# EAGLE schematic ModbusGateway4GWiFi (EAGLE 9.6.2)
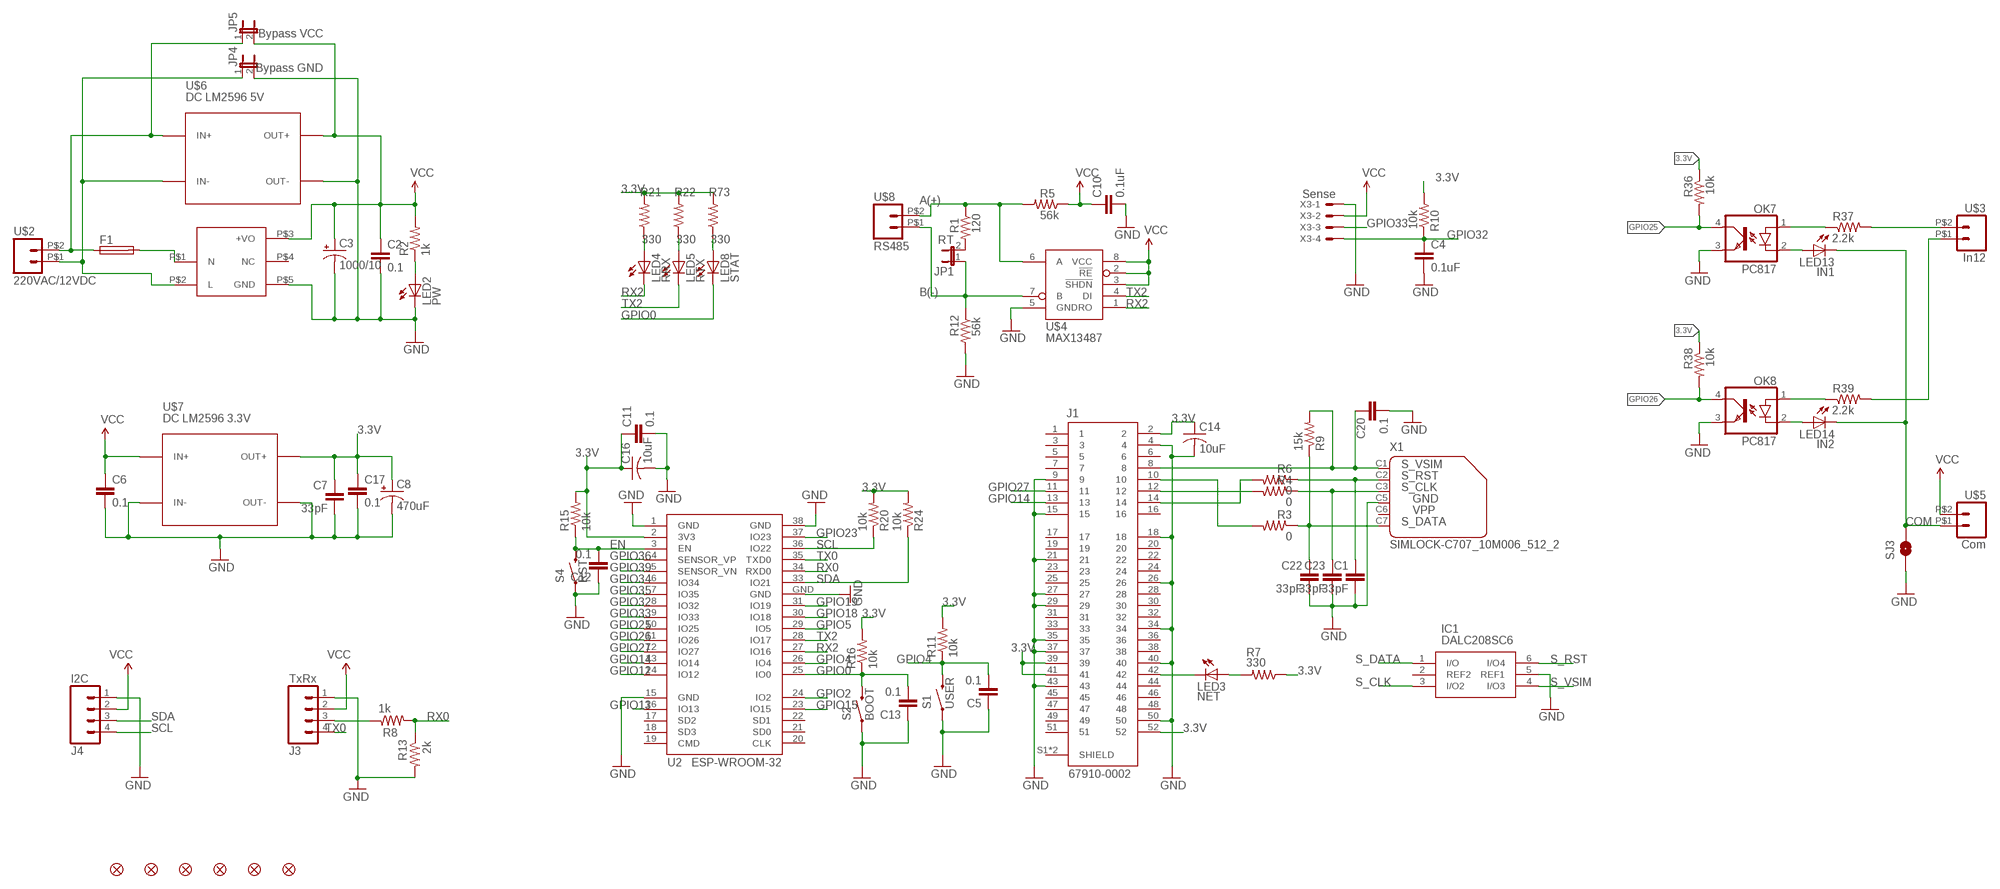
[diagram p0: schematic, sheet 1]

## Parts
C1  33pF  CAP0805  [0805]
C2  0.1  CAP0805  [0805]
C3  1000/10  CPOL-US140CLH-1010  [140CLH-1010]
C4  0.1uF  CAP0805  [0805]
C5  0.1  CAP0805  [0805]
C6  0.1  CAP0805  [0805]
C7  33pF  CAP0805  [0805]
C8  470uF  CPOL-US175TMP-0810  [175TMP-0810]
C10  0.1uF  CAP0805  [0805]
C11  0.1  CAP0805  [0805]
C12  0.1  CAP0805  [0805]
C13  0.1  CAP0805  [0805]
C14  10uF  C-USC1206  [C1206]
C16  10uF  C-USC1206  [C1206]
C17  0.1  CAP0805  [0805]
C20  0.1  CAP0805  [0805]
C22  33pF  CAP0805  [0805]
C23  33pF  CAP0805  [0805]
F1  SH22,5A  [SH22,5A]
IC1  DALC208SC6  [SOT95P280X145-6N]
J1  67910-0002  [MOLEX_67910-0002]
J3  TxRx  M04POLAR  [MOLEX-1X4]
J4  I2C  M04POLAR  [MOLEX-1X4]
JP1  RT  JUMPER-2PTH  [1X02]
JP4  Bypass GND  JUMPER-2SMD-NO  [SJ_2S-NO]
JP5  Bypass VCC  JUMPER-2SMD-NO  [SJ_2S-NO]
JP8  FIDUCIAL1X2  [FIDUCIAL-1X2]
JP9  FIDUCIAL1X2  [FIDUCIAL-1X2]
JP10  FIDUCIAL1X2  [FIDUCIAL-1X2]
JP11  FIDUCIAL1X2  [FIDUCIAL-1X2]
JP12  FIDUCIAL1X2  [FIDUCIAL-1X2]
JP16  FIDUCIAL1X2  [FIDUCIAL-1X2]
LED2  PW  LEDCHIP-LED0805  [CHIP-LED0805]
LED3  NET  LEDCHIP-LED0805  [CHIP-LED0805]
LED4  RRX  LEDCHIP-LED0805  [CHIP-LED0805]
LED5  RTX  LEDCHIP-LED0805  [CHIP-LED0805]
LED8  STAT  LEDCHIP-LED0805  [CHIP-LED0805]
LED13  IN1  LEDCHIP-LED0805  [CHIP-LED0805]
LED14  IN2  LEDCHIP-LED0805  [CHIP-LED0805]
OK7  PC817  LTV816S  [DIL4-SMD]
OK8  PC817  LTV816S  [DIL4-SMD]
R1  120  RESISTOR0805-RES  [0805]
R2  1k  RESISTOR0805-RES  [0805]
R3  0  RESISTOR0805-RES  [0805]
R4  0  RESISTOR0805-RES  [0805]
R5  56k  RESISTOR0805-RES  [0805]
R6  0  RESISTOR0805-RES  [0805]
R7  330  RESISTOR0805-RES  [0805]
R8  1k  RESISTOR0805-RES  [0805]
R9  15k  RESISTOR0805-RES  [0805]
R10  10k  RESISTOR0805-RES  [0805]
R11  10k  RESISTOR0805-RES  [0805]
R12  56k  RESISTOR0805-RES  [0805]
R13  2k  RESISTOR0805-RES  [0805]
R15  10k  RESISTOR0805-RES  [0805]
R16  10k  RESISTOR0805-RES  [0805]
R20  10k  RESISTOR0805-RES  [0805]
R21  330  RESISTOR0805-RES  [0805]
R22  330  RESISTOR0805-RES  [0805]
R24  10k  RESISTOR0805-RES  [0805]
R36  10k  RESISTOR0805-RES  [0805]
R37  2.2k  RESISTOR0805-RES  [0805]
R38  10k  RESISTOR0805-RES  [0805]
R39  2.2k  RESISTOR0805-RES  [0805]
R73  330  RESISTOR0805-RES  [0805]
S1  USER  SWITCH-MOMENTARY-2SMD-1101NE  [TACTILE-SWITCH-1101NE]
S2  BOOT  SWITCH-MOMENTARY-2SMD-1101NE  [TACTILE-SWITCH-1101NE]
S4  RST  SWITCH-MOMENTARY-2SMD-1101NE  [TACTILE-SWITCH-1101NE]
SJ3  JUMP COM to GND  SOLDERJUMPERNO  [SJ_2S-NO]
U2  ESP-WROOM-32  [ESP-WROOM-32]
U$1  HIECUBE  [HIECUBE]
U$2  220VAC/12VDC  5EHDRC-2P  [5EHDRC-2P]
U$3  In12  5EHDRC-2P  [5EHDRC-2P]
U$4  MAX13487  [SOIC8-1.27-5X4MM]
U$5  Com  5EHDRC-2P  [5EHDRC-2P]
U$6  DC LM2596 5V  DC-DC-STEP-DOWN-LM2596  [DC-DC-STEP-DOWN-LM2596]
U$7  DC LM2596 3.3V  DC-DC-STEP-DOWN-LM2596  [DC-DC-STEP-DOWN-LM2596]
U$8  RS485  5EHDRC-2P  [5EHDRC-2P]
X1  SIMLOCK-C707_10M006_512_2  [C707_10M006_512_2]
X3  Sense  JST-XH-04-PIN-LONG-PAD  [JST-XH-04-PACKAGE-LONG-PAD]

## Nets
3.3V: C7.1 C8.+ C11.1 C14.1 C16.1 C17.1 J1.2 J1.39 J1.41 J1.52 R7.1 R10.2 R11.2 R15.2 R16.2 R20.2 R21.2 R22.2 R24.2 R36.1 R38.1 R73.2 U2.2(3V3) U$7.OUT+
A(+): R1.1 R5.2 U$4.6(A) U$8.P$2
B(-): JP1.1 R12.1 U$4.7(B) U$8.P$1
COM: LED13.C LED14.C SJ3.2 U$5.P$1
EN: C12.2 R15.1 S4.2 U2.3(EN)
GND: C1.2 C2.2 C3.- C4.2 C5.1 C6.2 C7.2 C8.- C10.2 C11.2 C12.1 C13.1 C14.2 C16.2 C17.2 C20.2 C22.2 C23.2 IC1.5(REF1) J1.4 J1.9 J1.15 J1.18 J1.21 J1.26 J1.27 J1.29 J1.34 J1.35 J1.37 J1.40 J1.43 J1.50 J3.1 J4.1 JP4.2 LED2.C OK7.3(EMIT) OK8.3(EMIT) R12.2 R13.2 S1.1 S2.1 S4.1 SJ3.1 U2.1(GND) U2.15(GND) U2.38(GND) U2.GND U$1.P$5(GND) U$4.5(GND) U$6.OUT- U$7.IN- U$7.OUT- X1.C5 X3.1
GPIO0: C13.2 LED8.C R16.1 S2.2 U2.25(IO0)
GPIO2: U2.24(IO2)
GPIO4: C5.2 R11.1 S1.2 U2.26(IO4)
GPIO5: U2.29(IO5)
GPIO12: U2.14(IO12)
GPIO13: U2.16(IO13)
GPIO14: J1.13 U2.13(IO14)
GPIO15: U2.23(IO15)
GPIO18: U2.30(IO18)
GPIO19: U2.31(IO19)
GPIO23: U2.37(IO23)
GPIO25: OK7.4(COL) R36.2 U2.10(IO25)
GPIO26: OK8.4(COL) R38.2 U2.11(IO26)
GPIO27: J1.11 U2.12(IO27)
GPIO32: C4.1 R10.1 U2.8(IO32) X3.4
GPIO33: U2.9(IO33) X3.3
GPIO34: U2.6(IO34)
GPIO35: U2.7(IO35)
GPIO36: U2.4(SENSOR_VP)
GPIO39: U2.5(SENSOR_VN)
N$1: JP1.2 R1.2
N$3: J1.10 R3.2
N$5: JP4.1 U$1.P$2(L) U$2.P$1 U$6.IN-
N$6: LED2.A R2.1
N$7: J1.12 R4.2
N$8: J3.3 R8.1
N$10: J1.14 R6.2
N$14: J1.42 LED3.C
N$15: LED3.A R7.2
N$26: F1.2 U$1.P$1(N)
N$48: LED4.A R21.1
N$49: LED5.A R22.1
N$54: LED8.A R73.1
N$60: OK7.1(A) R37.1
N$62: LED13.A OK7.2(C)
N$63: OK8.1(A) R39.1
N$65: LED14.A OK8.2(C)
N$68: R37.2 U$3.P$2
N$71: R39.2 U$3.P$1
RX0: R8.2 R13.1 U2.34(RXD0)
RX2: LED4.C U2.27(IO16) U$4.1(RO)
S_CLK: C23.1 IC1.3(I/O2) R4.1 X1.C3
S_DATA: C22.1 IC1.1(I/O) R3.1 R9.1 X1.C7
S_RST: C1.1 IC1.6(I/O4) R6.1 X1.C2
S_VSIM: C20.1 IC1.4(I/O3) J1.8 R9.2 X1.C1
SCL: J4.4 R20.1 U2.36(IO22)
SDA: J4.3 R24.1 U2.33(IO21)
TX0: J3.4 U2.35(TXD0)
TX2: LED5.C U2.28(IO17) U$4.4(DI)
VCC: C2.1 C3.+ C6.1 C10.1 J3.2 J4.2 JP5.2 R2.2 R5.1 U$1.P$3(+VO) U$4.2(!RE) U$4.3(!SHDN) U$4.8(VCC) U$5.P$2 U$6.OUT+ U$7.IN+ X3.2
VS: F1.1 JP5.1 U$2.P$2 U$6.IN+
Unconnected: IC1.2(REF2) J1.1 J1.3 J1.5 J1.6 J1.7 J1.16 J1.17 J1.19 J1.20 J1.22 J1.23 J1.24 J1.25 J1.28 J1.30 J1.31 J1.32 J1.33 J1.36 J1.38 J1.44 J1.45 J1.46 J1.47 J1.48 J1.49 J1.51 J1.S1(SHIELD) J1.S2(SHIELD) U2.17(SD2) U2.18(SD3) U2.19(CMD) U2.20(CLK) U2.21(SD0) U2.22(SD1) U$1.P$4(NC) X1.C6

## Notes on the sheet
- GND
- VPP

## Library data of the parts
C1 C2 C4-C7 C10-C13 C17 C20 C22 C23 = SparkFun-Passives:CAP: Capacitor Standard 0603 ceramic capacitor, and 0.1" leaded capacitor.
C3 C8 = adafruit:CPOL-US: POLARIZED CAPACITOR, American symbol
C14 C16 = adafruit:C-US: CAPACITOR, American symbol
F1 = fuse:SH22,5A: FUSE HOLDER grid 22,5mm, isolated cap OGN0031 8201, Schurter (Buerklin)
IC1 = SamacSys_Parts:DALC208SC6: TVS Diode Array DALC208SC6 Octal, SOT-23 6-Pin Source: Datasheet <https://componentsearchengine.com/Datasheets/1/DALC208SC6.pdf>; DESCRIPTION: TVS Diode Array DALC208SC6 Octal, SOT-23 6-Pin; HEIGHT: 1.45mm; MANUFACTURER_NAME: STMicroelectronics; MANUFACTURER_PART_NUMBER: DALC208SC6; MOUSER_PART_NUMBER: 511-DALC208SC6; MOUSER_PRICE-STOCK: https://www.mouser.com/Search/Refine.aspx?Keyword=511-DALC208SC6
J1 = 67910-0002:67910-0002: 52 Position Female Connector PCI Express Mini Card Gold 0.031" (0.80mm) Black Check prices <https://pricing.snapeda.com/parts/67910-0002/Molex/view-part?ref=eda>; AVAILABILITY: Warning; DESCRIPTION: 52 Position Female Connector PCI Express Mini Card Gold 0.031 (0.80mm) Black; MF: Molex; MP: 67910-0002; PACKAGE: None; PRICE: None; PURCHASE-URL: https://pricing.snapeda.com/search/part/67910-0002/?ref=eda
J3 J4 = SparkFun-Connectors:M04: Header 4 Standard 4-pin 0.1" header. Use with straight break away headers (SKU : PRT-00116), right angle break away headers (PRT-00553), swiss pins (PRT-00743), machine pins (PRT-00117), and female headers (PRT-00115). Molex polarized connector foot print use with SKU : PRT-08231 with associated crimp pins and housings. 1MM SMD Version SKU: PRT-10208
JP1 = SparkFun:JUMPER-2: Jumper Basic 0.1" spaced jumper. Use with breakaway headers.
JP4 JP5 = SparkFun-Retired:JUMPER-2: Jumper Basic 0.1" spaced jumper. Use with breakaway headers.
JP8-JP12 JP16 = SparkFun:FIDUCIAL: Fiducial Alignment Points Various fiducial points for machine vision alignment.
LED2-LED5 LED8 = led:LED: LED
LED13 LED14 = adafruit:LED: LED
OK7 OK8 = optocoupler:LTV816: OPTO COUPLER Source: LITEON, LTV816.pdf
R1-R13 R15 R16 R20-R22 R24 R36-R39 R73 = SparkFun-Resistors:RESISTOR: Resistor Basic schematic elements and footprints for 0603, 1206, and PTH resistors.
S1 S2 S4 = SparkFun-Electromechanical:SWITCH-MOMENTARY-2: Various NO switches- pushbuttons, reed, etc; PROD_ID: SWCH-00815
SJ3 = SparkFun:SOLDERJUMPER: Solder Jumper Standard SMD solder jumper. Used to automate production. Two varients : Normally Open and Normally Closed are the same, but have different paste layers. NC will have a large amount of paste and should jumper during reflow.
U2 = esp32:ESP-WROOM-32: Espressif Systems ESP-WROOM-32
U$1 = HICUBE:HIECUBE
U$2 U$3 U$5 U$8 = ES-CONNECTOR:5EHDRC-2P
U$4 = TCS-MAXIM:MAX13487
U$6 U$7 = diy-modules:DC-DC-STEP-DOWN-LM2596: DC/DC Step-Down Regulator based on LM2596-ADJ chip LM2596 datasheet available here: http://www.ti.com/lit/ds/symlink/lm2596.pdf Click here to find device on ebay.com <http://www.ebay.com/sch/lm2596+power+regulator>
X1 = con-amphenol:SIMLOCK-C707_10M006_512_2: C707A SIMLOCK® 2.5 mm with wide solder tails Source: Data sheet <http://www.amphenol.info/downloads/C707_10M006_512_2.pdf>; OC_FARNELL: unknown; OC_NEWARK: unknown
X3 = Rembrandt Electronics - JST XH Connectors v1-0:JST-XH-04-PIN: JST XH Connector 2 Pin Wire to board connector. Pitch: 2,54 mm, (0.100") Number of pins: 4 Created by Rembrandt Electronics www.rembrandtelectronics.com